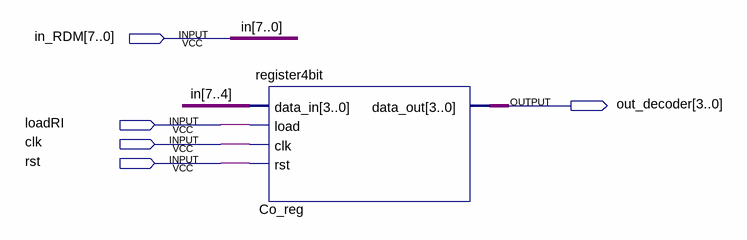
[diagram p0: schematic sheet]
// Quartus schematic reg_opcode.bdf as structural Verilog: 1 symbols, 5 pins
module reg_opcode (
  input  [7:0] in_RDM,
  input  loadRI,
  input  clk,
  input  rst,
  output [3:0] out_decoder
);

  register4bit Co_reg (.data_in(in_RDM[7:4]), .load(loadRI), .clk(clk), .rst(rst), .data_out(out_decoder));

  // Other names for the same wires on the sheet: in[7:0] = in_RDM
endmodule
